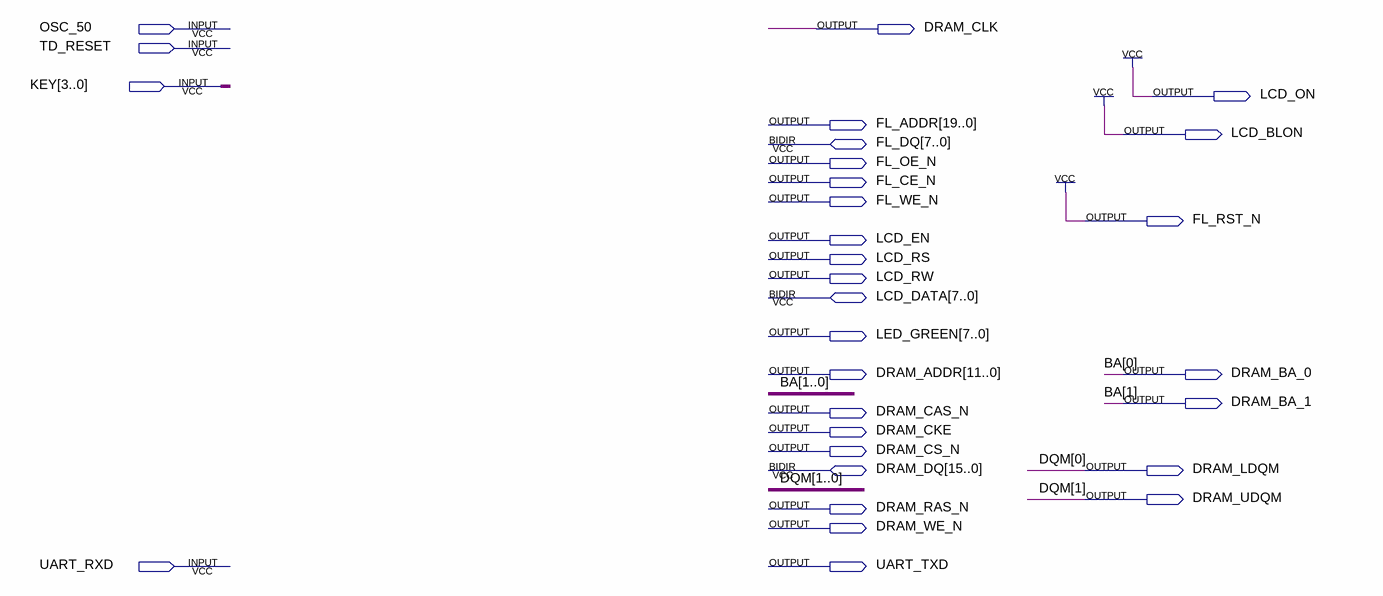
[diagram p0: schematic sheet]
// Quartus schematic DE2Project.bdf as structural Verilog: 0 symbols, 30 pins
module DE2Project (
  input  OSC_50,
  input  TD_RESET,
  input  [3:0] KEY,
  input  UART_RXD,
  inout  [7:0] FL_DQ,
  inout  [7:0] LCD_DATA,
  inout  [15:0] DRAM_DQ,
  output DRAM_CLK,
  output LCD_ON,
  output [19:0] FL_ADDR,
  output LCD_BLON,
  output FL_OE_N,
  output FL_CE_N,
  output FL_WE_N,
  output FL_RST_N,
  output LCD_EN,
  output LCD_RS,
  output LCD_RW,
  output [7:0] LED_GREEN,
  output [11:0] DRAM_ADDR,
  output DRAM_BA_0,
  output DRAM_BA_1,
  output DRAM_CAS_N,
  output DRAM_CKE,
  output DRAM_CS_N,
  output DRAM_LDQM,
  output DRAM_UDQM,
  output DRAM_RAS_N,
  output DRAM_WE_N,
  output UART_TXD
);


  assign FL_RST_N = 1'b1;
  assign LCD_BLON = 1'b1;
  assign LCD_ON = 1'b1;

  // Other names for the same wires on the sheet: BA[1:0] = {DRAM_BA_1, DRAM_BA_0}; DQM[1:0] = {DRAM_UDQM, DRAM_LDQM}
endmodule
